# Altium project CTR-Lower-Main-Board-Rev-C.PrjPcb (part 2 of 4)

## Sheet CTR-Lower-Main-Board-Rev-C-Motor.SchDoc: ZoZbot Lower Main Board - Motor
size B; Author: RMG; Organization: OLogic, Inc.; DocumentNumber: LMB4; Revision: C; SheetNumber: 4; SheetTotal: 10; PageSetup: Record=PageOptions|CenterHorizontal=True|CenterVertical=True|PrintScale=0.70|XCorrection=1.00|YCorrection=1.00|PrintKind=0|BorderSize=5000000|LeftOffset=0|BottomOffset=0|Orientation=2|PaperLength=1000|PaperWidth=1000|Scale=100|PaperSource=15|PrintQuality=600|MediaType=1|DitherType=10|PrintScaleMode=1|PaperKind=Letter|PaperIndex=1
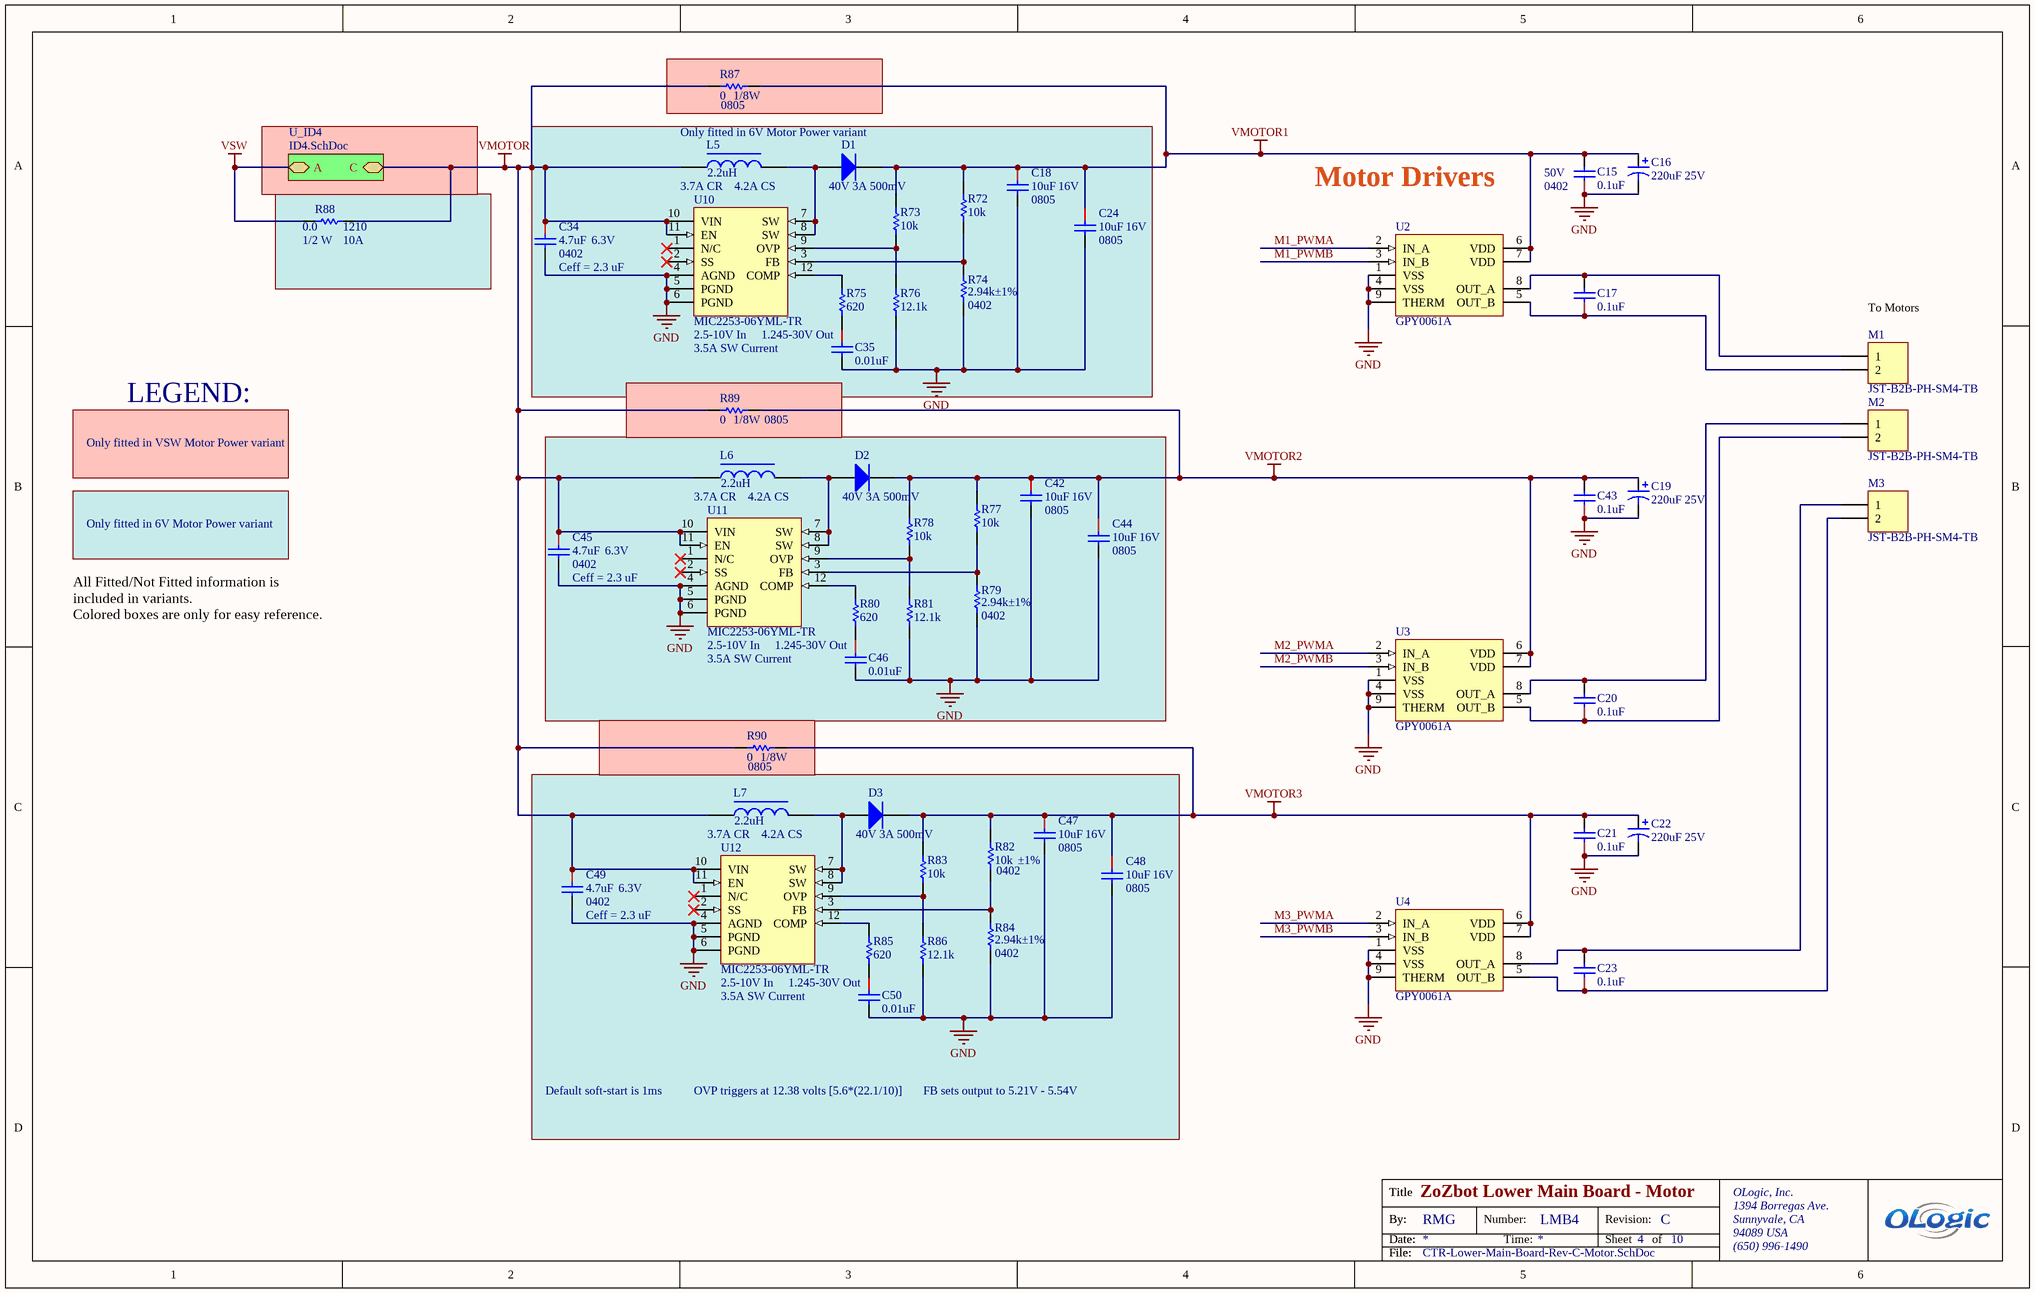
[diagram p3: CTR-Lower-Main-Board-Rev-C-Motor.SchDoc]

### Parts
C15  0.1uF  Voltage - Rated: 50V  Package / Case: 0402  [CAPC0402(1005)_N]
C16  220uF 25V  [U2-P-M]
C17  0.1uF  [CAPC0402(1005)_N]
C18  10uF  Voltage - Rated: 16V  Package / Case: 0805  [CAPC0805(2012)_L]
C19  220uF 25V  [U2-P-M]
C20  0.1uF  [CAPC0402(1005)_N]
C21  0.1uF  [CAPC0402(1005)_N]
C22  220uF 25V  [U2-P-M]
C23  0.1uF  [CAPC0402(1005)_N]
C24  10uF  Voltage - Rated: 16V  Package / Case: 0805  [CAPC0805(2012)_L]
C34  4.7uF  Voltage - Rated: 6.3V  Package / Case: 0402  [CAPC0402(1005)_N]
C35  0.01uF  [CAPC0402(1005)_N]
C42  10uF  Voltage - Rated: 16V  Package / Case: 0805  [CAPC0805(2012)_L]
C43  0.1uF  [CAPC0402(1005)_N]
C44  10uF  Voltage - Rated: 16V  Package / Case: 0805  [CAPC0805(2012)_L]
C45  4.7uF  Voltage - Rated: 6.3V  Package / Case: 0402  [CAPC0402(1005)_N]
C46  0.01uF  [CAPC0402(1005)_N]
C47  10uF  Voltage - Rated: 16V  Package / Case: 0805  [CAPC0805(2012)_L]
C48  10uF  Voltage - Rated: 16V  Package / Case: 0805  [CAPC0805(2012)_L]
C49  4.7uF  Voltage - Rated: 6.3V  Package / Case: 0402  [CAPC0402(1005)_N]
C50  0.01uF  [CAPC0402(1005)_N]
D1  40V 3A 500mV  [DO-214AB  SODFL794X250-2L]
D2  40V 3A 500mV  [DO-214AB  SODFL794X250-2L]
D3  40V 3A 500mV  [DO-214AB  SODFL794X250-2L]
L5  2.2uH  Current Rating: 3.7A CR  Current - Saturation: 4.2A CS  [IND_TAIYO_NR6028]
L6  2.2uH  Current Rating: 3.7A CR  Current - Saturation: 4.2A CS  [IND_TAIYO_NR6028]
L7  2.2uH  Current Rating: 3.7A CR  Current - Saturation: 4.2A CS  [IND_TAIYO_NR6028]
M1  JST-B2B-PH-SM4-TB  [JST-B2B-PH-SM4-TB]
M2  JST-B2B-PH-SM4-TB  [JST-B2B-PH-SM4-TB]
M3  JST-B2B-PH-SM4-TB  [JST-B2B-PH-SM4-TB]
R72  10K  [RESC0402(1005)_N]
R73  10K  [RESC0402(1005)_N]
R74  2.94k  Tolerance: ±1%  Supplier Device Package: 0402  [RESC0402(1005)_N]
R75  620  [RESC0603(1608)_N]
R76  12.1K  [RESC0402(1005)_N]
R77  10K  [RESC0402(1005)_N]
R78  10K  [RESC0402(1005)_N]
R79  2.94k  Tolerance: ±1%  Supplier Device Package: 0402  [RESC0402(1005)_N]
R80  620  [RESC0603(1608)_N]
R81  12.1K  [RESC0402(1005)_N]
R82  Tolerance: ±1%  Supplier Device Package: 0402  [RESC0402(1005)_N]  (hidden comment: 10K)
R83  10K  [RESC0402(1005)_N]
R84  2.94k  Tolerance: ±1%  Supplier Device Package: 0402  [RESC0402(1005)_N]
R85  620  [RESC0603(1608)_N]
R86  12.1K  [RESC0402(1005)_N]
R87  0  Power (Watts): 1/8W  Supplier Device Package: 0805  [RESC0805(2012)_N]
R88  0.0  Case/Package: 1210  Max Power Dissipation: 1/2 W  Current Rating: 10A  [RESC1210(3225)_L]
R89  0  Power (Watts): 1/8W  Supplier Device Package: 0805  [RESC0805(2012)_N]
R90  0  Power (Watts): 1/8W  Supplier Device Package: 0805  [RESC0805(2012)_N]
U2  GPY0061A  [SOG.050/8C-T]
U3  GPY0061A  [SOG.050/8C-T]
U4  GPY0061A  [SOG.050/8C-T]
U10  3.5A SW Current  input voltage: 2.5-10V In  Manufacturer Part Number: MIC2253-06YML-TR  output voltage: 1.245-30V Out  [QFN50P300X300X90_HS-13L (MIC2253)]
U11  3.5A SW Current  input voltage: 2.5-10V In  Manufacturer Part Number: MIC2253-06YML-TR  output voltage: 1.245-30V Out  [QFN50P300X300X90_HS-13L (MIC2253)]
U12  3.5A SW Current  input voltage: 2.5-10V In  Manufacturer Part Number: MIC2253-06YML-TR  output voltage: 1.245-30V Out  [QFN50P300X300X90_HS-13L (MIC2253)]

### Blocks framed on the sheet
Ceff = 2.3 uF: C42 C44-C46 D2 L6 R77-R81 U11

### Sub-sheets
U_ID4 = ID4.SchDoc: A, C

### Nets
GND: C15.1 C16.2 C18.2 C19.2 C21.1 C22.2 C24.2 C34.2 C35.2 C42.2 C43.1 C44.2 C45.2 C46.2 C47.2 C48.2 C49.2 C50.2 M1.0 M2.0 M3.0 R74.1 R76.1 R79.1 R81.1 R84.1 R86.1 U2.1(VSS) U2.4(VSS) U2.9(THERM) U3.1(VSS) U3.4(VSS) U3.9(THERM) U4.1(VSS) U4.4(VSS) U4.9(THERM) U10.4(AGND) U10.5(PGND) U10.6(PGND) U10.13(GND) U11.4(AGND) U11.5(PGND) U11.6(PGND) U11.13(GND) U12.4(AGND) U12.5(PGND) U12.6(PGND) U12.13(GND)
VMOTOR: C34.1 C45.1 C49.1 L5.1 L6.1 L7.1 R87.2 R88.1 R89.2 R90.2 U10.10(VIN) U10.11(EN) U11.10(VIN) U11.11(EN) U12.10(VIN) U12.11(EN) ; sheet U_ID4/C
VMOTOR1: C15.2 C16.1 C18.1 C24.1 D1.2(K) R72.2 R73.2 R87.1 U2.6(VDD) U2.7(VDD)
VMOTOR2: C19.1 C42.1 C43.2 C44.1 D2.2(K) R77.2 R78.2 R89.1 U3.6(VDD) U3.7(VDD)
VMOTOR3: C21.2 C22.1 C47.1 C48.1 D3.2(K) R82.2 R83.2 R90.1 U4.6(VDD) U4.7(VDD)
VSW: R88.2 ; sheet U_ID4/A
M1_PWMA: U2.2(IN_A)
M1_PWMB: U2.3(IN_B)
M2_PWMA: U3.2(IN_A)
M2_PWMB: U3.3(IN_B)
M3_PWMA: U4.2(IN_A)
M3_PWMB: U4.3(IN_B)
NetC17_1: C17.1 M1.2 U2.5(OUT_B)
NetC17_2: C17.2 M1.1 U2.8(OUT_A)
NetC20_1: C20.1 M2.2 U3.5(OUT_B)
NetC20_2: C20.2 M2.1 U3.8(OUT_A)
NetC23_1: C23.1 M3.2 U4.5(OUT_B)
NetC23_2: C23.2 M3.1 U4.8(OUT_A)
NetC35_1: C35.1 R75.1
NetC46_1: C46.1 R80.1
NetC50_1: C50.1 R85.1
NetD1_1: D1.1(A) L5.2 U10.7(SW) U10.8(SW)
NetD2_1: D2.1(A) L6.2 U11.7(SW) U11.8(SW)
NetD3_1: D3.1(A) L7.2 U12.7(SW) U12.8(SW)
NetR72_1: R72.1 R74.2 U10.3(FB)
NetR73_1: R73.1 R76.2 U10.9(OVP)
NetR75_2: R75.2 U10.12(COMP)
NetR77_1: R77.1 R79.2 U11.3(FB)
NetR78_1: R78.1 R81.2 U11.9(OVP)
NetR80_2: R80.2 U11.12(COMP)
NetR82_1: R82.1 R84.2 U12.3(FB)
NetR83_1: R83.1 R86.2 U12.9(OVP)
NetR85_2: R85.2 U12.12(COMP)

Not connected (* = marked no-connect by the designer): U10 1(N/C)* 2(SS)*; U11 1(N/C)* 2(SS)*; U12 1(N/C)* 2(SS)*

### Notes on the sheet
- Only fitted in 6V Motor Power variant
- Motor Drivers
- (near C34) Ceff = 2.3 uF
- (near M1) To Motors
- LEGEND:
- Only fitted in VSW Motor Power variant
- All Fitted/Not Fitted information is included in variants.
  Colored boxes are only for easy reference.
- (near C49) Ceff = 2.3 uF
- Default soft-start is 1ms
- OVP triggers at 12.38 volts [5.6*(22.1/10)]
- FB sets output to 5.21V - 5.54V
- Title
- By:
- Date:
- Number:
- Time:
- Revision:
- Sheet
- of
- OLogic, Inc.
- 1394 Borregas Ave.
- Sunnyvale, CA
- 94089 USA
- File:
- (650) 996-1490

### Library data of the parts
C15 C17 C20 C21 C23 C43 = CAP CER 0.1UF 50V 10% X7R 0402: 0.1uF 0402 50V; Manufacturer: TDK Corporation; Manufacturer Part Number: CGA2B3X7R1H104K050BB; Capacitance: 0.1µF; Tolerance: ±10%; Temperature Coefficient: X7R; Supplier 1: Digi-Key; RoHS: RoHS Compliant; Category: Capacitors; Stock 1: 1584397; Pricing 1: 1=0.16, 10=0.11, 100=0.0523, 250=0.044, 500=0.03686, 1000=0.03025, 5000=0.02558 (USD); Packaging: Cut Tape (CT); Mounting Type: Surface Mount, MLCC; Operating Temperature: -55°C ~ 125°C; Applications: Automotive; Ratings: AEC-Q200; Size / Dimension: 0.039" L x 0.020" W (1.00mm x 0.50mm); Height - Seated (Max): -; Thickness (Max): 0.022" (0.55mm); Lead Spacing: -; Features: -; Lead Style: -; ComponentLink1URL: http://product.tdk.com/en/catalog/datasheets/mlcc_automotive_general_en.pdf; ComponentLink1Description: http://product.tdk.com/en/catalog/datasheets/mlcc_automotive_general_en.pdf; Supplier Part Number 1: 445-6899-1-ND; Creator: osman
  C15: ClassName: motor1
  C17: Voltage - Rated: 50V; Package / Case: 0402 (1005 Metric); ClassName: motor1
  C20 C43: Voltage - Rated: 50V; Package / Case: 0402 (1005 Metric); ClassName: motor2
  C21 C23: Voltage - Rated: 50V; Package / Case: 0402 (1005 Metric); ClassName: motor3
C16 C19 C22 = CAP ALUM 220UF 25V 20% SMD CHEAPER: 220uF 25V CAN; Manufacturer: Nichicon; Manufacturer Part Number: UWT1E221MNL1GS; Capacitance: 220µF; Tolerance: ±20%; Lifetime @ Temp.: 1000 Hrs @ 105°C; Polarization: Polar; Ripple Current: 155mA; Surface Mount Land Size: 0.327" L x 0.327" W (8.30mm x 8.30mm); Supplier 1: Digi-Key; RoHS: RoHS Compliant; Category: Capacitors; Stock 1: 17601; Pricing 1: 1=0.42, 10=0.3, 25=0.256, 50=0.2268, 100=0.1975, 250=0.16824 (USD); Packaging: Cut Tape (CT); Part Status: Active; Voltage Rating: 25V; ESR (Equivalent Series Resistance): -; Operating Temperature: -55°C ~ 105°C; Applications: General Purpose; Impedance: -; Lead Spacing: -; Size / Dimension: 0.315" Dia (8.00mm); Height - Seated (Max): 0.394" (10.00mm); Mounting Type: Surface Mount; Package / Case: Radial, Can - SMD; ComponentLink1URL: http://nichicon-us.com/english/products/pdfs/e-uwt.pdf; ComponentLink1Description: http://nichicon-us.com/english/products/pdfs/e-uwt.pdf; Supplier Part Number 1: 493-2192-1-ND
C18 C24 C42 C44 C47 C48 = CAP CER 10UF 16V 10% X5R 0805: 10UF 0805 16V; Manufacturer: Murata Electronics North America; Manufacturer Part Number: GRM21BR61C106KE15L; Capacitance: 10µF; Tolerance: ±10%; Temperature Coefficient: X5R; Supplier 1: Digi-Key; RoHS: RoHS Compliant; Category: Capacitors; Stock 1: 1725870; Pricing 1: 1=0.25, 10=0.171, 50=0.1038, 100=0.0872, 250=0.07056, 500=0.06226, 1000=0.05291 (USD); Packaging: Cut Tape (CT); Mounting Type: Surface Mount, MLCC; Operating Temperature: -55°C ~ 85°C; Applications: General Purpose; Ratings: -; Size / Dimension: 0.079" L x 0.049" W (2.00mm x 1.25mm); Height - Seated (Max): -; Thickness (Max): 0.053" (1.35mm); Lead Spacing: -; Features: -; Lead Style: -; ComponentLink1URL: http://www.murata.com/products/catalog/pdf/c02e.pdf; ComponentLink1Description: http://www.murata.com/products/catalog/pdf/c02e.pdf; Supplier Part Number 1: 490-3886-1-ND
  C18 C24: ClassName: Motor1Reg
  C42 C44: ClassName: Motor2Reg
  C47 C48: ClassName: Motor3Reg
C34 C45 C49 = CAP CER 4.7UF 6.3V 10% X5R 0402: 4.7uF 0402; Manufacturer: Murata Electronics North America; Manufacturer Part Number: GRM155R60J475ME47D; Capacitance: 4.7µF; Tolerance: ±20%; Temperature Coefficient: X5R; Supplier 1: Digi-Key; RoHS: RoHS Compliant; Category: Capacitors; Stock 1: 162576; Pricing 1: 1=0.15, 10=0.1, 50=0.0576, 100=0.0475, 250=0.04, 500=0.0335, 1000=0.0275, 5000=0.02325 (USD); Packaging: Cut Tape (CT); Mounting Type: Surface Mount, MLCC; Operating Temperature: -55°C ~ 85°C; Applications: General Purpose; Ratings: -; Size / Dimension: 0.039" L x 0.020" W (1.00mm x 0.50mm); Height - Seated (Max): -; Thickness (Max): 0.024" (0.60mm); Lead Spacing: -; Features: -; Lead Style: -; ComponentLink1URL: http://www.murata.com/~/media/webrenewal/support/library/catalog/products/capacitor/mlcc/c02e.ashx; ComponentLink1Description: http://www.murata.com/~/media/webrenewal/support/library/catalog/products/capacitor/mlcc/c02e.ashx; Supplier Part Number 1: 490-5915-1-ND
  C34: ClassName: Motor1Reg
  C45: ClassName: Motor2Reg
  C49: ClassName: Motor3Reg
C35 C46 C50 = CAP CER 0.01UF 25V 10% X5R 0402: 0.01uF 0402; Manufacturer: Murata Electronics North America; Manufacturer Part Number: GRM155R71E103KA01D; Capacitance: 10000pF; Tolerance: ±10%; Voltage - Rated: 25V; Temperature Coefficient: X7R; Supplier 1: Digi-Key; RoHS: RoHS Compliant; Category: Capacitors; Stock 1: 4802323; Pricing 1: 1=0.1, 10=0.012, 50=0.0066, 100=0.0057, 250=0.00464, 500=0.00396, 1000=0.00309, 5000=0.00258 (USD); Packaging: Cut Tape (CT); Mounting Type: Surface Mount, MLCC; Operating Temperature: -55°C ~ 125°C; Applications: General Purpose; Ratings: -; Package / Case: 0402 (1005 Metric); Size / Dimension: 0.039" L x 0.020" W (1.00mm x 0.50mm); Height - Seated (Max): -; Thickness (Max): 0.022" (0.55mm); Lead Spacing: -; Features: -; Lead Style: -; ComponentLink1URL: http://www.murata.com/~/media/webrenewal/support/library/catalog/products/capacitor/mlcc/c02e.ashx; ComponentLink1Description: http://www.murata.com/~/media/webrenewal/support/library/catalog/products/capacitor/mlcc/c02e.ashx; Supplier Part Number 1: 490-1312-1-ND
  C35: ClassName: Motor1Reg
  C46: ClassName: Motor2Reg
  C50: ClassName: Motor3Reg
D1-D3 = B340-13-F: DIODE SCHOTTKY 40V 3A DO-214AB; Manufacturer: Diodes Incorporated; Capacitance @ Vr, F: 200pF @ 4V, 1MHz; Current - Reverse Leakage @ Vr: 500µA @ 40V; Speed: Fast Recovery =< 500ns, > 200mA (Io); Voltage - Forward (Vf) (Max) @ If: 500mV @ 3A; Supplier 1: Digi-Key; Manufacturer Part Number: B340-13-F; Stock 1: 40982; Packaging: Cut Tape (CT); ComponentLink1URL: https://www.diodes.com/assets/Datasheets/ds30923.pdf; ComponentLink1Description: https://www.diodes.com/assets/Datasheets/ds30923.pdf; Supplier Part Number 1: B340-FDICT-ND; Category: Discrete Semiconductor Products; Current - Average Rectified (Io): 3A; Diode Type: Schottky; Mounting Type: Surface Mount; Operating Temperature - Junction: -55°C ~ 125°C; Package / Case: DO-214AB, SMC; Part Status: Active; Pricing 1: 1=0.39, 10=0.32, 100=0.2175, 500=0.16316, 1000=0.12236 (USD); RoHS: RoHS Compliant; Supplier Device Package: SMC; Voltage - DC Reverse (Vr) (Max): 40V
L5-L7 = INDUCTOR 2.2UH 4.2A 30% SMD: 2.2uH 6x6mm; Manufacturer: Taiyo Yuden; Manufacturer Part Number: NR6028T2R2N; PN: 587-2098-1-ND; Material - Core: Ferrite; Inductance: 2.2µH; Tolerance: ±30%; Shielding: Shielded; DC Resistance (DCR): 26 mOhm Max; Frequency - Self Resonant: 68MHz; Frequency - Test: 100kHz; Supplier 1: Digi-Key; RoHS: RoHS Compliant; Category: Inductors, Coils, Chokes; Stock 1: 48258; Pricing 1: 1=0.29, 10=0.276, 50=0.2588, 100=0.2415, 500=0.18974, 1000=0.15525 (USD); Packaging: Cut Tape (CT); Type: -; Q @ Freq: -; Operating Temperature: -25°C ~ 120°C; Mounting Type: Surface Mount; Package / Case: Non Standard; Size / Dimension: 0.236" L x 0.236" W (6.00mm x 6.00mm); Height - Seated (Max): 0.110" (2.80mm); Supplier Device Package: -; ComponentLink1URL: http://www.yuden.co.jp/productdata/catalog/en/wound04_e.pdf; ComponentLink1Description: http://www.yuden.co.jp/productdata/catalog/en/wound04_e.pdf; Supplier Part Number 1: 587-2098-1-ND
  L5: ClassName: Motor1Reg
  L6: ClassName: Motor2Reg
  L7: ClassName: Motor3Reg
M1-M3 = JST-B2B-PH-SM4-TB: 2mm Locking Header, 2-Pin; Manufacturer: JST; MPN: B2B-PH-SM4-TB(LF)(SN); Vendor: Digikey; PN: 455-1734-1-ND; Connector Type: Header, Shrouded; Number of Positions: 2; Number of Positions Loaded: All; Pitch: 0.079" (2.00mm); Supplier 1: Digi-Key; Manufacturer Part Number: B2B-PH-SM4-TB(LF)(SN); RoHS: RoHS Compliant; Category: Connectors, Interconnects; Stock 1: 43142; Pricing 1: 1=0.51, 10=0.478, 50=0.3824, 100=0.3664, 250=0.33456, 500=0.31862 (USD); Packaging: Cut Tape (CT); Contact Type: Male Pin; Number of Rows: 1; Row Spacing: -; Contact Mating Length: -; Mounting Type: Surface Mount; Termination: Solder; Fastening Type: -; Features: Solder Retention; Contact Finish: Tin; Contact Finish Thickness: -; Color: Natural; ComponentLink1URL: http://www.jst-mfg.com/product/pdf/eng/ePH.pdf; ComponentLink1Description: http://www.jst-mfg.com/product/pdf/eng/ePH.pdf; Supplier Part Number 1: 455-1734-1-ND
R72 R73 R77 R78 R83 = RES 10K OHM 1% 1/10W 0402: 10K 0402; Manufacturer: Panasonic Electronic Components; Manufacturer Part Number: ERJ-2RKF1002X; Tolerance: ±1%; Power (Watts): 0.1W, 1/10W; Temperature Coefficient: ±100ppm/°C; Supplier 1: Digi-Key; RoHS: RoHS Compliant; Category: Resistors; Stock 1: 8784573; Pricing 1: 1=0.1, 50=0.0196, 100=0.0149, 250=0.01104, 500=0.00816, 1000=0.00544, 5000=0.00383 (USD); Packaging: Cut Tape (CT); Composition: Thick Film; Features: Automotive AEC-Q200; Operating Temperature: -55°C ~ 155°C; Package / Case: 0402 (1005 Metric); Supplier Device Package: 0402; Size / Dimension: 0.039" L x 0.020" W (1.00mm x 0.50mm); Height: 0.016" (0.40mm); Number of Terminations: 2; ComponentLink1URL: http://industrial.panasonic.com/www-cgi/jvcr13pz.cgi?E+PZ+3+AOA0002+ERJ2RKF1002X+7+WW; ComponentLink1Description: http://industrial.panasonic.com/www-cgi/jvcr13pz.cgi?E+PZ+3+AOA0002+ERJ2RKF1002X+7+WW; Supplier Part Number 1: P10.0KLCT-ND; Creator: osman; Resistance (Ohms): 10k
  R72 R73: ClassName: Motor1Reg
  R77 R78: ClassName: Motor2Reg
  R83: ClassName: Motor3Reg
R74 R79 R84 = RES 10K OHM 1% 1/10W 0402: 2.94K 0402; Manufacturer: Yageo; Manufacturer Part Number: RC0402FR-072K94L; Description: RES SMD 2.94K OHM 1% 1/16W 0402; Power (Watts): 0.063W, 1/16W; Temperature Coefficient: ±100ppm/°C; Supplier 1: Digi-Key; Supplier Part Number 1: YAG3107TR-ND; RoHS: RoHS Compliant; Category: Resistors; Stock 1: 90000; Pricing 1: 10000=0.00134, 30000=0.00118, 50000=0.00108, 100000=0.00107 (USD); Packaging: Tape & Reel (TR); Part Status: Active; Resistance (Ohms): 2.94k; Composition: Thick Film; Features: Moisture Resistant; Operating Temperature: -55°C ~ 155°C; Package / Case: 0402 (1005 Metric); Size / Dimension: 0.039" L x 0.020" W (1.00mm x 0.50mm); Height - Seated (Max): 0.016" (0.40mm); Failure Rate: -; ComponentLink1URL: http://www.yageo.com/documents/recent/PYu-RC_Group_51_RoHS_L_7.pdf; ComponentLink1Description: http://www.yageo.com/documents/recent/PYu-RC_Group_51_RoHS_L_7.pdf; Supplier 2: Digi-Key; Supplier Part Number 2: YAG3107CT-ND
R75 R80 R85 = RES 620 OHM 1% 1/10W 0603: 620 0603; Manufacturer: Vishay Dale; Manufacturer Part Number: CRCW0603620RFKEA; Tolerance: ±1%; Power (Watts): 0.1W, 1/10W; Temperature Coefficient: ±100ppm/°C; Supplier 1: Digi-Key; RoHS: RoHS Compliant; Category: Resistors; Stock 1: 13562; Pricing 1: 10=0.081, 50=0.0436, 200=0.0251, 1000=0.01711 (USD); Packaging: Cut Tape (CT); Resistance (Ohms): 620; Composition: Thick Film; Features: Automotive AEC-Q200; Operating Temperature: -55°C ~ 155°C; Package / Case: 0603 (1608 Metric); Supplier Device Package: 0603 (1608 Metric); Size / Dimension: 0.061" L x 0.033" W (1.55mm x 0.85mm); Height: 0.020" (0.50mm); Number of Terminations: 2; ComponentLink1URL: http://www.vishay.com/docs/20035/dcrcwe3.pdf; ComponentLink1Description: http://www.vishay.com/docs/20035/dcrcwe3.pdf; Supplier Part Number 1: 541-620HCT-ND
  R75: ClassName: Motor1Reg
  R80: ClassName: Motor2Reg
  R85: ClassName: Motor3Reg
R76 R81 R86 = RES 12.1K OHM 1% 1/10W 0402: 12.1K 0402; Manufacturer: Panasonic Electronic Components; Manufacturer Part Number: ERJ-2RKF1212X; Tolerance: ±1%; Power (Watts): 0.1W, 1/10W; Temperature Coefficient: ±100ppm/°C; Supplier 1: Digi-Key; RoHS: RoHS Compliant; Category: Resistors; Stock 1: 212610; Pricing 1: 1=0.1, 50=0.0196, 100=0.0149, 250=0.01104, 500=0.00816, 1000=0.00544, 5000=0.00383 (USD); Packaging: Cut Tape (CT); Composition: Thick Film; Features: Automotive AEC-Q200; Operating Temperature: -55°C ~ 155°C; Package / Case: 0402 (1005 Metric); Supplier Device Package: 0402; Size / Dimension: 0.039" L x 0.020" W (1.00mm x 0.50mm); Height: 0.016" (0.40mm); Number of Terminations: 2; ComponentLink1URL: http://industrial.panasonic.com/www-cgi/jvcr13pz.cgi?E+PZ+3+AOA0002+ERJ2RKF1212X+7+WW; ComponentLink1Description: http://industrial.panasonic.com/www-cgi/jvcr13pz.cgi?E+PZ+3+AOA0002+ERJ2RKF1212X+7+WW; Supplier Part Number 1: P12.1KLCT-ND; Creator: osman; Resistance (Ohms): 12.1k
  R76: ClassName: Motor1Reg
  R81: ClassName: Motor2Reg
  R86: ClassName: Motor3Reg
R82 = RES 10K OHM 1% 1/10W 0402: 10K 0402; Manufacturer: Panasonic Electronic Components; Manufacturer Part Number: ERJ-2RKF1002X; Power (Watts): 0.1W, 1/10W; Temperature Coefficient: ±100ppm/°C; Supplier 1: Digi-Key; RoHS: RoHS Compliant; Category: Resistors; Stock 1: 8784573; Pricing 1: 1=0.1, 50=0.0196, 100=0.0149, 250=0.01104, 500=0.00816, 1000=0.00544, 5000=0.00383 (USD); Packaging: Cut Tape (CT); Composition: Thick Film; Features: Automotive AEC-Q200; Operating Temperature: -55°C ~ 155°C; Package / Case: 0402 (1005 Metric); Size / Dimension: 0.039" L x 0.020" W (1.00mm x 0.50mm); Height: 0.016" (0.40mm); Number of Terminations: 2; ComponentLink1URL: http://industrial.panasonic.com/www-cgi/jvcr13pz.cgi?E+PZ+3+AOA0002+ERJ2RKF1002X+7+WW; ComponentLink1Description: http://industrial.panasonic.com/www-cgi/jvcr13pz.cgi?E+PZ+3+AOA0002+ERJ2RKF1002X+7+WW; Supplier Part Number 1: P10.0KLCT-ND; Creator: osman; Resistance (Ohms): 10k; ClassName: Motor3Reg
R87 R89 R90 = RES 0.0 OHM 1/8W JUMP 0805 SMD: 0 0805; Manufacturer: Panasonic Electronic Components; Manufacturer Part Number: ERJ-6GEY0R00V; Resistance (Ohms): 0.0; Tolerance: Jumper; Supplier 1: Digi-Key; RoHS: RoHS Compliant; Category: Resistors; Stock 1: 1384038; Pricing 1: 1=0.1, 50=0.0196, 100=0.0149, 250=0.01104, 500=0.00816, 1000=0.00544, 2500=0.00459 (USD); Packaging: Cut Tape (CT); Composition: Thick Film; Features: -; Temperature Coefficient: -; Package / Case: 0805 (2012 Metric); Size / Dimension: 0.079" L x 0.049" W (2.00mm x 1.25mm); Height: 0.028" (0.70mm); Number of Terminations: 2; ComponentLink1URL: http://industrial.panasonic.com/www-cgi/jvcr13pz.cgi?E+PZ+3+AOA0001+ERJ6GEY0R00V+7+WW; ComponentLink1Description: http://industrial.panasonic.com/www-cgi/jvcr13pz.cgi?E+PZ+3+AOA0001+ERJ6GEY0R00V+7+WW; Supplier Part Number 1: P0.0ACT-ND
R88 = RES SMD 0.0 OHM JUMPER 1/2W 1210: 0 2010 50mOhm; Manufacturer: Stackpole Electronics; Manufacturer Part Number: RMCF1210ZT0R00; Resistance: 0; Power Rating: 330; Tolerance: 1; Supplier 1: Digikey; Stock 1: 749044; Pricing 1: 1=0.11, 10=0.1, 25=0.0692, 50=0.054, 100=0.0385, 250=0.03, 500=0.0239, 1000=0.0169 (USD); Mount: Surface Mount; Case Code (Metric): 3225; Case Code (Imperial): 1210; Min Operating Temperature: -55; Max Operating Temperature: 155; Packaging: Tape and Reel; Composition: Thick Film; Terminations: 2; Contact Plating: Tin; Length: 0.126; Height: 0.028; Width: 0.098; Radiation Hardening: No; Lead Free: Lead Free; ComponentLink1URL: https://www.seielect.com/catalog/SEI-RMCF_RMCP.pdf; ComponentLink1Description: https://www.seielect.com/catalog/SEI-RMCF_RMCP.pdf; Supplier Part Number 1: RMCF1210ZT0R00CT-ND
U2 = GPY0061A: 2A Motor Driver; Manufacturer: GeneralPlus; Supplier 1: Spectrum Rep.; Manufacturer Part Number: GPY0061A; Supplier Part Number 1: GPY0061A; ClassName: motor1
U3 U4 = GPY0061A: 2A Motor Driver; Manufacturer: GeneralPlus; Vendor: Spectrum Rep.; MPN: GPY0061A; PN: GPY0061A; Manufacturer Part Number: GPY0061A; Supplier 1: Spectrum Rep.; Supplier Part Number 1: GPY0061A
  U3: ClassName: motor2
  U4: ClassName: motor3
U10-U12 = MIC2253: Wide Range 3.5A Boost Converter; Manufacturer: Microchip Technology; Output Current: 3.5; Switching Frequency: 1; Min Input Voltage: 2.5; Max Input Voltage: 10; Max Output Voltage: 30; Synchronous Rectifier: No; Min Output Voltage: 1.245; Supplier 1: Digikey; Stock 1: 36936; Pricing 1: 1=1.07, 25=0.896, 100=0.8137 (USD); Mount: Surface Mount; Pins: 12; Min Operating Temperature: -40; Max Operating Temperature: 125; Packaging: Tape and Reel,Cut Tape; Outputs: 1; REACH SVHC: No SVHC; ComponentLink1URL: http://www.farnell.com/datasheets/1833732.pdf; ComponentLink1Description: http://www.farnell.com/datasheets/1833732.pdf; Supplier Part Number 1: 576-3643-1-ND
  U10: ClassName: Motor1Reg
  U11: ClassName: Motor2Reg
  U12: ClassName: Motor3Reg

## Sheet ID4.SchDoc: ZoZbot Lower Main Board - ID4
size B; Author: RMG; Organization: OLogic, Inc.; DocumentNumber: LMB6; Revision: C; SheetNumber: 6; SheetTotal: 10; PageSetup: Record=PageOptions|CenterHorizontal=True|CenterVertical=True|PrintScale=0.70|XCorrection=1.00|YCorrection=1.00|PrintKind=0|BorderSize=5000000|LeftOffset=0|BottomOffset=0|Orientation=2|PaperLength=1000|PaperWidth=1000|Scale=100|PaperSource=15|PrintQuality=600|MediaType=1|DitherType=10|PrintScaleMode=1|PaperKind=Letter|PaperIndex=1
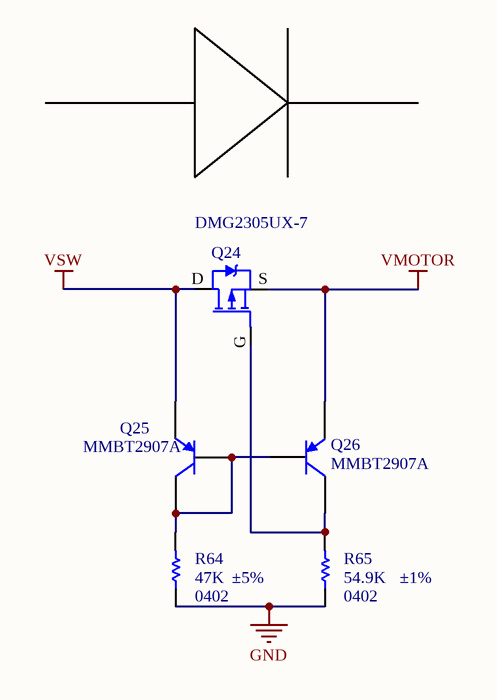
[diagram p4: ID4.SchDoc]

### Parts
Q24  DMG2305UX  [DMG2305UX-7]  (value not drawn)
Q25  MMBT2907A  [SOT23]
Q26  MMBT2907A  [SOT23]
R64  47K  Tolerance: ±5%  Supplier Device Package: 0402  [RESC0402(1005)_N]
R65  54.9K  Tolerance: ±1%  Supplier Device Package: 0402  [RESC0402(1005)_N]

### Nets
GND: R64.1 R65.1
VMOTOR: Q24.S Q26.2(E)
VSW: Q24.D Q25.2(E)
NetQ24_G: Q24.G Q26.3(C) R65.2
NetQ25_1: Q25.1(B) Q25.3(C) Q26.1(B) R64.2

### Notes on the sheet
- Title
- By:
- Date:
- Number:
- Time:
- Revision:
- Sheet
- of
- OLogic, Inc.
- 1394 Borregas Ave.
- Sunnyvale, CA
- 94089 USA
- File:
- (650) 996-1490

### Library data of the parts
Q24 = DMG2305UX: MOSFET P-CH 20V 4.2A SOT23; Manufacturer: Diodes Incorporated; FET Type: MOSFET P-Channel, Metal Oxide; FET Feature: Standard; Current - Continuous Drain (Id) @ 25°C: 4.2A (Ta); Rds On (Max) @ Id, Vgs: 52 mOhm @ 4.2A, 4.5V; Vgs(th) (Max) @ Id: 900mV @ 250µA; Gate Charge (Qg) @ Vgs: 10.2nC @ 4.5V; Input Capacitance (Ciss) @ Vds: 808pF @ 15V; Power - Max: 1.4W; Supplier 1: Digi-Key; RoHS: RoHS Compliant; Category: Discrete Semiconductor Products; Stock 1: 78669; Pricing 1: 1=0.38, 10=0.311, 100=0.1649, 500=0.10846, 1000=0.0739 (USD); Packaging: Cut Tape (CT); Drain to Source Voltage (Vdss): 20V; Operating Temperature: -55°C ~ 150°C (TJ); Mounting Type: Surface Mount; Package / Case: TO-236-3, SC-59, SOT-23-3; Supplier Device Package: SOT-23; ComponentLink1URL: http://www.diodes.com/_files/datasheets/DMG2305UX.pdf; ComponentLink1Description: http://www.diodes.com/_files/datasheets/DMG2305UX.pdf; Supplier Part Number 1: DMG2305UX-7DICT-ND; Creator: osman; Manufacturer Part Number: DMG2305UX-7
Q25 Q26 = MMBT2907A: PNP General Purpose Amplifier; Manufacturer: Fairchild Semiconductor; Vendor: Digikey; PN: MMBT2907AFSCT-ND; Current - Collector (Ic) (Max): 800mA; Voltage - Collector Emitter Breakdown (Max): 60V; Vce Saturation (Max) @ Ib, Ic: 1.6V @ 50mA, 500mA; DC Current Gain (hFE) (Min) @ Ic, Vce: 100 @ 150mA, 10V; Power - Max: 350mW; Frequency - Transition: 200MHz; MPN: MMBT2907A; Supplier 1: Digi-Key; Manufacturer Part Number: MMBT2907A; RoHS: RoHS Compliant; Category: Discrete Semiconductor Products; Stock 1: 74892; Pricing 1: 1=0.2, 10=0.187, 25=0.17, 100=0.1224, 250=0.07208, 500=0.0598, 1000=0.04079 (USD); Packaging: Cut Tape (CT); Transistor Type: PNP; Current - Collector Cutoff (Max): -; Mounting Type: Surface Mount; Package / Case: TO-236-3, SC-59, SOT-23-3; Supplier Device Package: SOT-23; ComponentLink1URL: http://www.fairchildsemi.com/ds/MM/MMBT2907A.pdf; ComponentLink1Description: http://www.fairchildsemi.com/ds/MM/MMBT2907A.pdf; Supplier Part Number 1: MMBT2907AFSCT-ND
R64 = RES 47K OHM 5% 1/10W 0402: 47K 0402; Manufacturer: Panasonic Electronic Components; Manufacturer Part Number: ERJ-2GEJ473X; Power (Watts): 0.1W, 1/10W; Temperature Coefficient: ±200ppm/°C; Supplier 1: Digi-Key; RoHS: RoHS Compliant; Category: Resistors; Stock 1: 1670564; Pricing 1: 1=0.1, 50=0.0106, 100=0.0078, 250=0.00596, 500=0.00476, 1000=0.0035, 5000=0.00251 (USD); Packaging: Cut Tape (CT); Resistance (Ohms): 47k; Composition: Thick Film; Features: Automotive AEC-Q200; Operating Temperature: -55°C ~ 155°C; Package / Case: 0402 (1005 Metric); Size / Dimension: 0.039" L x 0.020" W (1.00mm x 0.50mm); Height: 0.016" (0.40mm); Number of Terminations: 2; ComponentLink1URL: http://industrial.panasonic.com/www-cgi/jvcr13pz.cgi?E+PZ+3+AOA0001+ERJ2GEJ473X+7+WW; ComponentLink1Description: http://industrial.panasonic.com/www-cgi/jvcr13pz.cgi?E+PZ+3+AOA0001+ERJ2GEJ473X+7+WW; Supplier Part Number 1: P47KJCT-ND
R65 = RES 54.9K OHM 1% 1/10W 0402: 54.9K 1% 0402; Manufacturer: Panasonic Electronic Components; Manufacturer Part Number: ERJ-2RKF5492X; Power (Watts): 0.1W, 1/10W; Temperature Coefficient: ±100ppm/°C; Supplier 1: Digi-Key; RoHS: RoHS Compliant; Category: Resistors; Stock 1: 151111; Pricing 1: 1=0.1, 50=0.015, 100=0.011, 250=0.0084, 500=0.00674, 1000=0.00496, 5000=0.00355 (USD); Packaging: Cut Tape (CT); Part Status: Active; Resistance (Ohms): 54.9k; Composition: Thick Film; Features: Automotive AEC-Q200; Operating Temperature: -55°C ~ 155°C; Package / Case: 0402 (1005 Metric); Size / Dimension: 0.039" L x 0.020" W (1.00mm x 0.50mm); Height - Seated (Max): 0.016" (0.40mm); Number of Terminations: 2; Failure Rate: -; ComponentLink1URL: http://industrial.panasonic.com/www-cgi/jvcr13pz.cgi?E+PZ+3+AOA0002+ERJ2RKF5492X+7+WW; ComponentLink1Description: http://industrial.panasonic.com/www-cgi/jvcr13pz.cgi?E+PZ+3+AOA0002+ERJ2RKF5492X+7+WW; Supplier Part Number 1: P54.9KLCT-ND